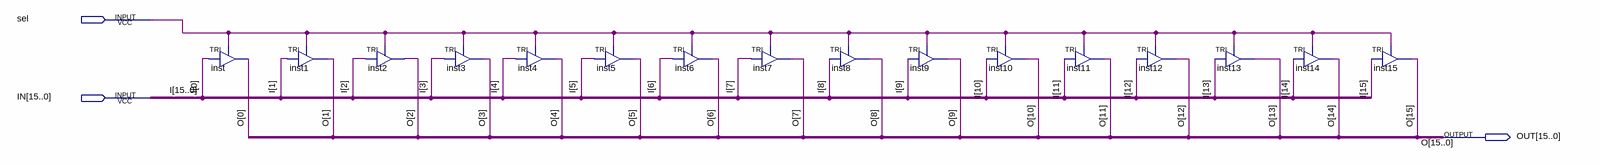
[diagram p0: schematic sheet]
// Quartus schematic TRI16.bdf as structural Verilog: 16 symbols, 3 pins
module TRI16 (
  input  sel,
  input  [15:0] IN,
  output [15:0] OUT
);

  TRI inst (.IN(IN[0]), .OE(sel), .OUT(OUT[0]));
  TRI inst1 (.IN(IN[1]), .OE(sel), .OUT(OUT[1]));
  TRI inst2 (.IN(IN[2]), .OE(sel), .OUT(OUT[2]));
  TRI inst3 (.IN(IN[3]), .OE(sel), .OUT(OUT[3]));
  TRI inst4 (.IN(IN[4]), .OE(sel), .OUT(OUT[4]));
  TRI inst5 (.IN(IN[5]), .OE(sel), .OUT(OUT[5]));
  TRI inst6 (.IN(IN[6]), .OE(sel), .OUT(OUT[6]));
  TRI inst7 (.IN(IN[7]), .OE(sel), .OUT(OUT[7]));
  TRI inst8 (.IN(IN[8]), .OE(sel), .OUT(OUT[8]));
  TRI inst9 (.IN(IN[9]), .OE(sel), .OUT(OUT[9]));
  TRI inst10 (.IN(IN[10]), .OE(sel), .OUT(OUT[10]));
  TRI inst11 (.IN(IN[11]), .OE(sel), .OUT(OUT[11]));
  TRI inst12 (.IN(IN[12]), .OE(sel), .OUT(OUT[12]));
  TRI inst13 (.IN(IN[13]), .OE(sel), .OUT(OUT[13]));
  TRI inst14 (.IN(IN[14]), .OE(sel), .OUT(OUT[14]));
  TRI inst15 (.IN(IN[15]), .OE(sel), .OUT(OUT[15]));

  // Other names for the same wires on the sheet: I[15:0] = IN; O[15:0] = OUT
endmodule
